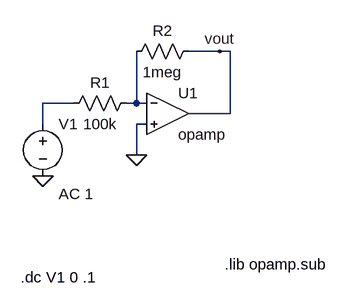
[diagram p0: schematic OpAmp01.asc]
OpAmp01.asc, the LTspice schematic file:
Version 4
SHEET 1 880 680
WIRE 256 0 208 0
WIRE 272 0 256 0
WIRE 32 80 -16 80
WIRE 128 80 128 0
WIRE 128 80 112 80
WIRE 144 80 128 80
WIRE 272 96 272 0
WIRE 272 96 208 96
WIRE -16 112 -16 80
WIRE 144 112 128 112
WIRE 128 160 128 112
FLAG -16 192 0
FLAG 128 160 0
FLAG 256 0 vout
SYMBOL voltage -16 96 R0
WINDOW 123 24 124 Left 2
WINDOW 39 0 0 Left 2
SYMATTR InstName V1
SYMATTR Value ""
SYMATTR Value2 AC 1
SYMBOL Opamps\\opamp 176 32 R0
SYMATTR InstName U1
SYMBOL res 128 64 R90
WINDOW 0 0 56 VBottom 2
WINDOW 3 32 56 VTop 2
SYMATTR InstName R1
SYMATTR Value 100k
SYMBOL res 224 -16 R90
WINDOW 0 0 56 VBottom 2
WINDOW 3 32 56 VTop 2
SYMATTR InstName R2
SYMATTR Value 1meg
TEXT 264 328 Left 2 !.lib opamp.sub
TEXT -50 348 Left 2 !.dc V1 0 .1

The netlist it stands for:
* OpAmp01.asc
V1 N001 0 AC 1
XU1 N002 0 vout opamp Aol=100K GBW=10Meg  ; pins invin noninvin out
R1 N002 N001 100k
R2 vout N002 1meg
.lib opamp.sub
.dc V1 0 .1
.backanno
.end